# Altium project ESP_WROOM_02_Measurement_V1.PrjPCB
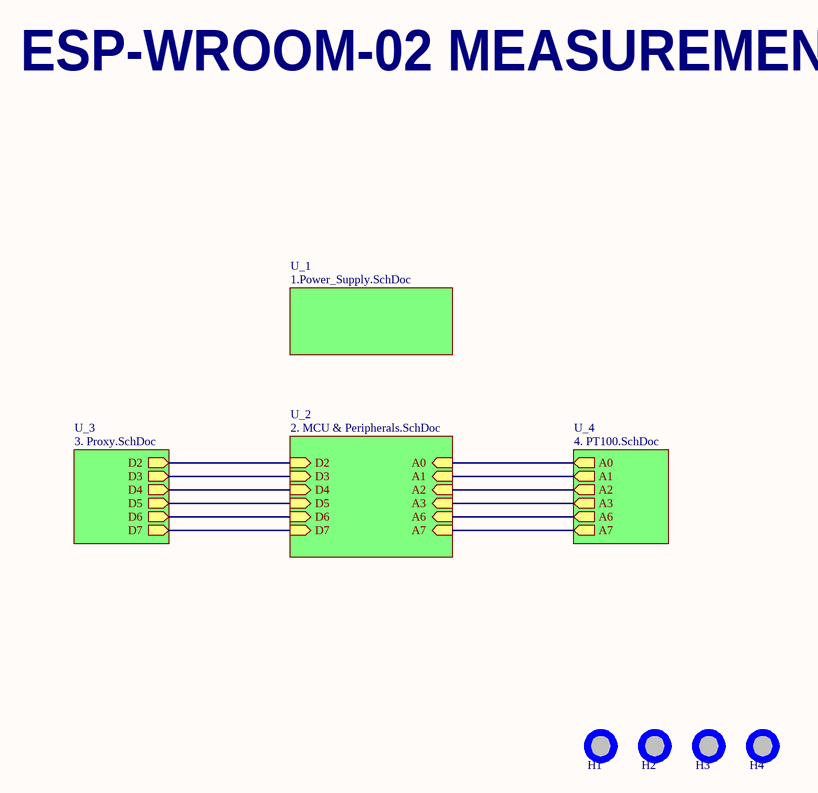
[diagram p0: Main_sch.SchDoc]
CompanyName: Keri Studio
5 sheets, 101 parts. Net scope: hierarchical (ports join the sheet entries above them; power ports are global).
Board file: Layout.PcbDoc
Sheets:
  Main_sch.SchDoc
    U_1 = 1.Power_Supply.SchDoc
    U_2 = 2. MCU & Peripherals.SchDoc
    U_3 = 3. Proxy.SchDoc
    U_4 = 4. PT100.SchDoc

## Sheet Main_sch.SchDoc: Main Schematic
size A4; CompanyName: Keri Studio; DrawnBy: Ashisg Talaviya; Organization: KERI STUDIO; Address1: ICG COMPOUND; Address2: NR. BHAVANI CIRCLE; Address3: A.K. ROAD; Address4: SURAT-395008; DocumentNumber: 0; Revision: 1.0; SheetNumber: 0; SheetTotal: 4

### Parts
H1  Hole  [Hole_4mm]  (value not drawn)  (no BOM)
H2  Hole  [Hole_4mm]  (value not drawn)  (no BOM)
H3  Hole  [Hole_4mm]  (value not drawn)  (no BOM)
H4  Hole  [Hole_4mm]  (value not drawn)  (no BOM)

### Sub-sheets
U_1 = 1.Power_Supply.SchDoc: no entries
U_2 = 2. MCU & Peripherals.SchDoc: A0 (in), A1 (in), A2 (in), A3 (in), A6 (in), A7 (in), D2 (in), D3 (in), D4 (in), D5 (in), D6 (in), D7 (in)
U_3 = 3. Proxy.SchDoc: D2 (out), D3 (out), D4 (out), D5 (out), D6 (out), D7 (out)
U_4 = 4. PT100.SchDoc: A0 (out), A1 (out), A2 (out), A3 (out), A6 (out), A7 (out)

### Nets
A0: sheet U_2/A0, sheet U_4/A0
A1: sheet U_2/A1, sheet U_4/A1
A2: sheet U_2/A2, sheet U_4/A2
A3: sheet U_2/A3, sheet U_4/A3
A6: sheet U_2/A6, sheet U_4/A6
A7: sheet U_2/A7, sheet U_4/A7
D2: sheet U_2/D2, sheet U_3/D2
D3: sheet U_2/D3, sheet U_3/D3
D4: sheet U_2/D4, sheet U_3/D4
D5: sheet U_2/D5, sheet U_3/D5
D6: sheet U_2/D6, sheet U_3/D6
D7: sheet U_2/D7, sheet U_3/D7

### Notes on the sheet
- ESP-WROOM-02 MEASUREMENT
- Title
- Size:
- A4
- Number:
- Revision:
- Date:
- Time:
- Sheet
- of

### Library data of the parts
H1-H4 = Hole: Corner Hole with 4mm Drill

## Sheet 1.Power_Supply.SchDoc: 1. Power Supply
size A4; CompanyName: Keri Studio; DrawnBy: Ashis Talaviya; Organization: KERI STUDIO; Address1: ICG COMPOUND; Address2: NR. BHAVANI CIRCLE; Address3: A.K. ROAD; Address4: SURAT-395008; DocumentNumber: 1; Revision: 1.0; SheetNumber: 1; SheetTotal: 4
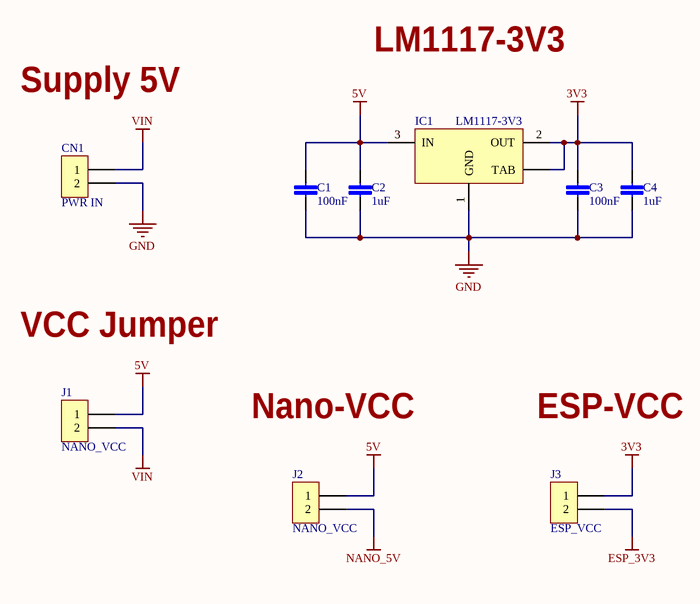
[diagram p1: 1.Power_Supply.SchDoc]

### Parts
C1  100nF  [C0805]
C2  1uF  [C0805]
C3  100nF  [C0805]
C4  1uF  [C0805]
CN1  PWR IN  [Terminal_5.08mm_1X02]
IC1  LM1117-3V3  [SOT223]
J1  NANO_VCC  [Header_2.54mm_1X02]
J2  NANO_VCC  [Header_2.54mm_1X02]
J3  ESP_VCC  [Header_2.54mm_1X02]

### Nets
3V3: C3.1 C4.1 IC1.2(OUT) IC1.4(TAB) J3.1
5V: C1.1 C2.1 IC1.3(IN) J1.1 J2.1
ESP_3V3: J3.2
GND: C1.2 C2.2 C3.2 C4.2 CN1.2 IC1.1(GND)
NANO_5V: J2.2
VIN: CN1.1 J1.2

### Notes on the sheet
- LM1117-3V3
- Supply 5V
- VCC Jumper
- Nano-VCC
- ESP-VCC
- Title
- Size:
- A4
- Number:
- Revision:
- Date:
- Time:
- Sheet
- of

### Library data of the parts
C1 C3 = C_0805_0.1uF: Multilayer Ceramic Capacitors MLCC - SMD/SMT 0805 0.1uF 50volts X7R 20%; Manufacturer: Murata; Manufacturer Part Number: GCJ21BR71H104MA01L; Supplier 1: Mouser; Supplier Part Number 1: 81-GCJ21BR71H104MA1L; Stock 1: 0
C2 C4 = C_0805_1uF: Multilayer Ceramic Capacitors MLCC - SMD/SMT 0805 1uF 50volts X7R 20%; Manufacturer: Murata; Manufacturer Part Number: GCJ21BR71H105MA01L; Supplier 1: Mouser; Supplier Part Number 1: 81-GCJ21BR71H105MA1L; Stock 1: 0; Pricing 1: 1=0.33, 10=0.231, 50=0.231, 100=0.139, 1000=0.088, 10000=0.074 (USD)
CN1 = Terminal_5.08mm_1X02: Fixed Terminal Blocks TERMI-BLOK PCB; Manufacturer: TE Connectivity; Manufacturer Part Number: 796682-2; Plating: Brass,Nickel; Number of Positions: 2; Number of Levels: 1; Current: 17.5A; Voltage: 300V; Connector Type: Receptacle; Closed End: No (Without); Interlock: Yes (With); Wire Gauge (Max): 30AWG; Pitch: 5mm; Thread Size: M3; Tail Length: 3.5mm; Supplier 1: Mouser; Stock 1: 1299; Pricing 1: 1=1.06, 10=0.737, 50=0.623, 100=0.62, 1000=0.441, 10000=0.367 (USD); Mount: Through Hole; Contact Plating: Tin; Contact Material: Brass; Colour: Black; Housing Material: Polyamide; Housing Colour: Black; Min Operating Temperature: -40°C; Max Operating Temperature: 105°C; Number of Rows: 1; Packaging: Bulk; Package Quantity: 300; Termination: Solder; Number of Positions Per Level: 2; Orientation: Straight; Max Current Rating: 17.5A; Current Rating: 17.5A; Voltage Rating: 300V; Number of Contacts: 2; Max Voltage Rating (AC): 300V; Number of Circuits: 2; Max Supply Voltage (AC): 300V; Screw Flange: No (Without); Screwless Terminal Block: No (Without); Side Stackable: No (Without); Length: 10.5mm; Height: 15.5mm; Wire Gauge (Min): 30AWG; Depth: 9mm; Width: 9mm; Radiation Hardening: No; Flammability Rating: UL94 V-0; Lead Free: Lead Free; ELV: Compliant; ComponentLink1URL: http://components.arrow.com/part/dataview/0323_03914338; ComponentLink1Description: http://components.arrow.com/part/dataview/0323_03914338; ComponentLink2URL: http://www.onlinecomponents.com/productFiles/mf-AMP/eng_cs_1308389_eurostyle_terminal_blocks_0607.pdf; ComponentLink2Description: http://www.onlinecomponents.com/productFiles/mf-AMP/eng_cs_1308389_eurostyle_terminal_blocks_0607.pdf; ComponentLink3URL: http://www.jameco.com/Jameco/Products/ProdDS/759341.pdf; ComponentLink3Description: http://www.jameco.com/Jameco/Products/ProdDS/759341.pdf; ComponentLink4URL: http://www.te.com/commerce/DocumentDelivery/DDEController?Action=showdoc&DocId=Catalog+Section%7F1308389_EUROSTYLE_TERMINAL_BLOCKS%7F0607%7Fpdf%7FEnglish%7FENG_CS_1308389_EUROSTYLE_TERMINAL_BLOCKS_0607.pdf; ComponentLink4Description: http://www.te.com/commerce/DocumentDelivery/DDEController?Action=showdoc&DocId=Catalog+Section%7F1308389_EUROSTYLE_TERMINAL_BLOCKS%7F0607%7Fpdf%7FEnglish%7FENG_CS_1308389_EUROSTYLE_TERMINAL_BLOCKS_0607.pdf; ComponentLink5URL: http://components.arrow.com/part/dataview/3050970S8348740N5665; ComponentLink5Description: http://components.arrow.com/part/dataview/3050970S8348740N5665; ComponentLink6URL: http://www.te.com/catalog/pn/en/796682-2?RQPN=796682-2; ComponentLink6Description: http://www.te.com/catalog/pn/en/796682-2?RQPN=796682-2; ComponentLink7URL: http://www.te.com/commerce/DocumentDelivery/DDEController?Action=srchrtrv&DocNm=796682&DocType=Customer+Drawing&DocLang=English; ComponentLink7Description: http://www.te.com/commerce/DocumentDelivery/DDEController?Action=srchrtrv&DocNm=796682&DocType=Customer+Drawing&DocLang=English; Supplier Part Number 1: 571-796682-2
IC1 = VREG_LM1117_3V3: IC, LINEAR VOLTAGE REGULATOR; Manufacturer: TI National Semiconductor; Manufacturer Part Number: LM1117MPX-3.3; Number of Outputs: 1; Output Voltage: 3.3V; Quiescent Current: 10mA; Output Current: 800mA; Dropout Voltage: 1.2V; Max Input Voltage: 15V; Polarity: Positive; Accuracy: 1%; Min Supply Voltage: 4.75V; Supplier 1: Mouser; Supplier Part Number 1: 926-LM1117MPX-33; Stock 1: 1423; Pricing 1: 1=1.54, 10=1.32, 50=1.32, 100=1.01, 1000=0.702, 10000=0.6 (USD); Mount: Surface Mount; Case/Package: SOT-223; Number of Pins: 4; Min Operating Temperature: -40°C; Max Operating Temperature: 125°C; Packaging: Tape and Reel; Current Rating: 800mA; Max Output Current: 800mA; Output Voltage Accuracy: 1%; Number of Regulators: 1; Min Current Limit: 800mA; Max Output Voltage: 3.3V; Max Supply Voltage: 15V; Termination: SMD/SMT; REACH SVHC: No SVHC; Lead Free: Contains Lead; ComponentLink1URL: https://datasheet.ciiva.com/8042/1882372-8042277.pdf; ComponentLink1Description: https://datasheet.ciiva.com/8042/1882372-8042277.pdf; ComponentLink2URL: https://datasheet.ciiva.com/1570/1831038-1570214.pdf; ComponentLink2Description: https://datasheet.ciiva.com/1570/1831038-1570214.pdf; ComponentLink3URL: https://datasheet.ciiva.com/1570/1772317-1570215.pdf; ComponentLink3Description: https://datasheet.ciiva.com/1570/1772317-1570215.pdf
J1-J3 = Header_2.54mm_1X02: TE Connectivity AMPMODU Mod II Series, 2.54mm Pitch 2 Way 1 Row Straight Breakaway Header, Solder Termination, 3A; Manufacturer Part Number: 826646-2; Number of Contacts: 2; Connector Type: Plug,Pin,Header; Board Standoff: No (Without); Plating Thickness: 0.8um; High Speed Serial Data Connector: No; PCB Mount Retention: Without; Mating Post Length: 5.8mm; Supplier 1: Mouser; Manufacturer: TE Connectivity; Stock 1: 37059; Pricing 1: 1=0.37, 10=0.343, 50=0.343, 100=0.263, 1000=0.189, 10000=0.157 (USD); Mount: Straddle Mount; Contact Plating: Tin,Gold; Colour: Green; Contact Material: Bronze; Housing Material: PBT; Housing Colour: Green; Contact Shape: Square; Min Operating Temperature: -65°C; Max Operating Temperature: 105°C; Number of Rows: 1; Termination: Through Hole; Packaging: Carton; Current Rating: 3A; Package Quantity: 3000; Contact Gender: Male; Number of Positions: 2; Orientation: Straight; Contact Protection: No (Without); Gasket: No (Without); High Temperature Housing: No; Keyed: No; Mating Alignment: No (Without); Mating Connector Lock: No (Without); Selectively Loaded: No (Without); Stabilizers: No (Without); Strain Relief: No (Without); Length: 5.08mm; Pitch: 2.54mm; Contact Mating Length: 0.228inch; Row Spacing: 2.54mm; Termination Post Length: 0.1259inch; Depth: 2.5mm; Radiation Hardening: No; Flammability Rating: UL94 V-0; ELV: Compliant; Lead Free: Lead Free; ComponentLink1URL: https://datasheet.ciiva.com/11746/0900766b80d7c469-11746485.pdf; ComponentLink1Description: https://datasheet.ciiva.com/11746/0900766b80d7c469-11746485.pdf; ComponentLink2URL: https://datasheet.ciiva.com/31842/8266462-31842526.pdf; ComponentLink2Description: https://datasheet.ciiva.com/31842/8266462-31842526.pdf; ComponentLink3URL: https://datasheet.ciiva.com/29369/001094740-da-01-en-stiftleiste-1-reihig-0-0826646-2-29369543.pdf; ComponentLink3Description: https://datasheet.ciiva.com/29369/001094740-da-01-en-stiftleiste-1-reihig-0-0826646-2-29369543.pdf; ComponentLink4URL: https://datasheet.ciiva.com/735/eng-cd-826629-aa-basefilename-735038.pdf; ComponentLink4Description: https://datasheet.ciiva.com/735/eng-cd-826629-aa-basefilename-735038.pdf; Supplier Part Number 1: 571-826646-2

## Sheet 2. MCU & Peripherals.SchDoc: 2. Arduino Nano & ESP-WROOM-32
size A4; CompanyName: Keri Studio; DrawnBy: Ashis Talaviya; Organization: KERI STUDIO; Address1: ICG COMPOUND; Address2: NR. BHAVANI CIRCLE; Address3: A.K. ROAD; Address4: SURAT-395008; DocumentNumber: 2; Revision: 1.0; SheetNumber: 2; SheetTotal: 4
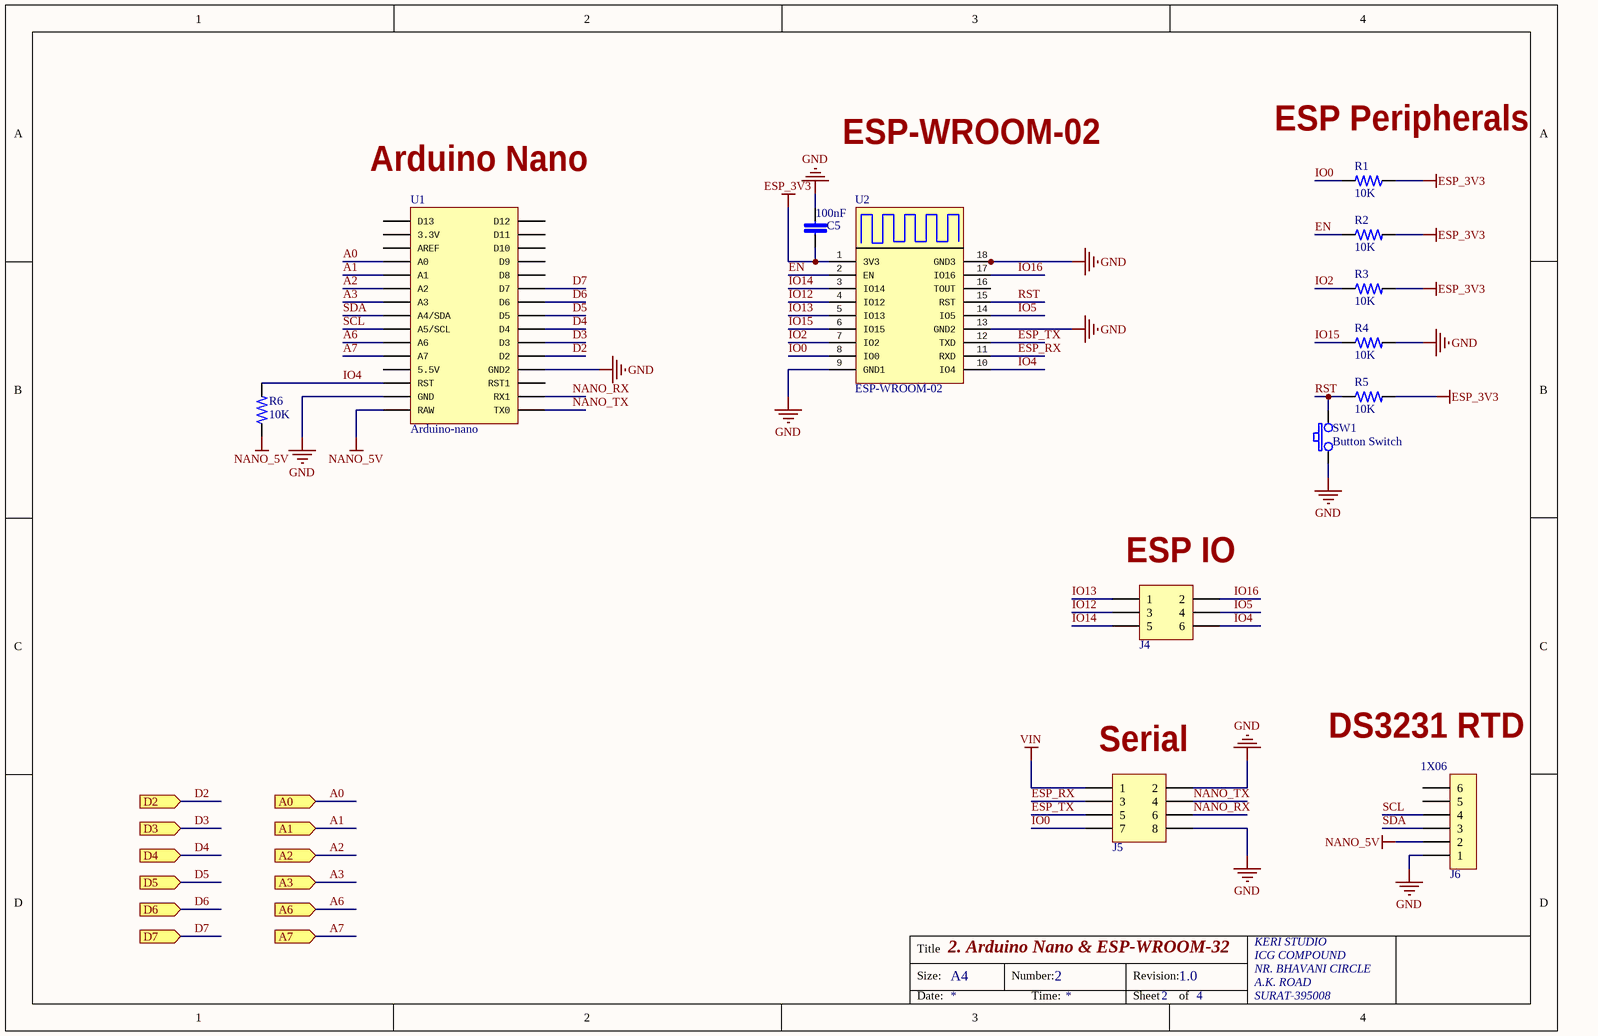
[diagram p2: 2. MCU & Peripherals.SchDoc]

### Parts
C5  100nF  [C0805]
J4  2X03  [Header_2.54mm_2X03]  (value not drawn)
J5  2X04  [Header_2.54mm_2X04]  (value not drawn)
J6  1X06  [Header_2.54mm_1X06]
R1  10K  [R0805]
R2  10K  [R0805]
R3  10K  [R0805]
R4  10K  [R0805]
R5  10K  [R0805]
R6  10K  [R0805]
SW1  Button Switch  [KSR231GLFS]
U1  Arduino-nano  [ARDUINO_NANO]
U2  ESP-WROOM-02  [ESP-WROOM-02]

### Ports
A0 (in), A1 (in), A2 (in), A3 (in), A6 (in), A7 (in), D2 (in), D3 (in), D4 (in), D5 (in), D6 (in), D7 (in)

### Nets
ESP_3V3: C5.2 R1.1 R2.2 R3.2 R5.2 U2.1(3V3)
GND: C5.1 J5.2 J5.8 J6.1 R4.2 SW1.1 U1.GND U1.GND1(GND2) U2.9(GND1) U2.13(GND2) U2.18(GND3) U2.19(GND0)
NANO_5V: J6.2 R6.1 U1.RAW
VIN: J5.1
A0: U1.A0 ; port A0
A1: U1.A1 ; port A1
A2: U1.A2 ; port A2
A3: U1.A3 ; port A3
A6: U1.A6 ; port A6
A7: U1.A7 ; port A7
D2: U1.D2 ; port D2
D3: U1.D3 ; port D3
D4: U1.D4 ; port D4
D5: U1.D5 ; port D5
D6: U1.D6 ; port D6
D7: U1.D7 ; port D7
EN: R2.1 U2.2(EN)
ESP_RX: J5.3 U2.11(RXD)
ESP_TX: J5.5 U2.12(TXD)
IO0: J5.7 R1.2 U2.8(IO0)
IO2: R3.1 U2.7(IO2)
IO4: J4.6 R6.2 U1.RST U2.10(IO4)
IO5: J4.4 U2.14(IO5)
IO12: J4.3 U2.4(IO12)
IO13: J4.1 U2.5(IO13)
IO14: J4.5 U2.3(IO14)
IO15: R4.1 U2.6(IO15)
IO16: J4.2 U2.17(IO16)
NANO_RX: J5.6 U1.RX1
NANO_TX: J5.4 U1.TX0
RST: R5.1 SW1.2 U2.15(RST)
SCL: J6.4 U1.A5(A5/SCL)
SDA: J6.3 U1.A4(A4/SDA)

Not connected (* = marked no-connect by the designer): J6 5 6; U1 3.3V 5V(5.5V) AREF D8 D9 D10 D11 D12 D13 RST1; U2 16(TOUT)

### Notes on the sheet
- (near U1) Arduino Nano
- ESP-WROOM-02
- (near R1) ESP Peripherals
- (near J4) ESP IO
- (near J5) Serial
- (near J6) DS3231 RTD
- Title
- Size:
- A4
- Number:
- Revision:
- Date:
- Time:
- Sheet
- of

### Library data of the parts
C5 = C_0805_0.1uF: as C1 on sheet 1.Power_Supply; Supplier 1: Mouser; Supplier Part Number 1: 81-GCJ21BR71H104MA1L; Stock 1: 0
J4 = Header_2.54mm_2X03: Headers & Wire Housings 03+03 DIL VERTICAL PIN HEADER TIN; Manufacturer: Harwin; Manufacturer Part Number: M20-9980346; Number of Contacts: 6; Contact Resistance: 25mR; Current Rating: 3A; Gender: Male; Insulation Resistance: 10GR; Connector Type: Male Pin; Pitch: 2.54mm; Row Spacing: 0.1inch; Supplier 1: Mouser; Stock 1: 8602; Pricing 1: 1=0.24, 10=0.229, 50=0.229, 100=0.159, 1000=0.11, 10000=0.089 (USD); Mount: Through Hole; Contact Plating: Nickel,Tin; Colour: Black; Contact Material: Bronze,Brass; Housing Colour: Black; Housing Material: Nylon; Min Operating Temperature: -40°C; Max Operating Temperature: 105°C; Number of Rows: 2; Termination: Solder; Package Quantity: 1000; Packaging: Bag; Max Current Rating: 3A; Number of Positions: 6; Orientation: Straight; Length: 7.62mm; Contact Mating Length: 0.24inch; Depth: 5.08mm; Radiation Hardening: No; REACH SVHC: No SVHC; ComponentLink1URL: https://datasheet.ciiva.com/11745/0900766b81034e61-11745752.pdf; ComponentLink1Description: https://datasheet.ciiva.com/11745/0900766b81034e61-11745752.pdf; ComponentLink2URL: https://datasheet.ciiva.com/26899/getdatasheetpartid-483857-26899433.pdf; ComponentLink2Description: https://datasheet.ciiva.com/26899/getdatasheetpartid-483857-26899433.pdf; ComponentLink3URL: https://datasheet.ciiva.com/8046/112195-8046906.pdf; ComponentLink3Description: https://datasheet.ciiva.com/8046/112195-8046906.pdf; Supplier Part Number 1: 855-M20-9980346
J5 = Header_2.54mm_2X04: Headers & Wire Housings 04+04 DIL VERTICAL PIN HEADER TIN; Manufacturer: Harwin; Manufacturer Part Number: M20-9980446; Number of Contacts: 8; Max Current Rating: 3A; Contact Resistance: 30mR; Gender: Male; Insulation Resistance: 10GR; Connector Type: Male Pin; Pitch: 2.54mm; Row Spacing: 0.1inch; Supplier 1: Mouser; Stock 1: 10983; Pricing 1: 1=0.3, 10=0.28, 50=0.28, 100=0.196, 1000=0.14, 10000=0.112 (USD); Mount: Through Hole; Contact Plating: Tin; Contact Material: Bronze,Brass; Colour: Black; Housing Colour: Black; Housing Material: Nylon; Min Operating Temperature: -40°C; Max Operating Temperature: 105°C; Number of Rows: 2; Termination: Solder; Current Rating: 3A; Package Quantity: 1000; Packaging: Bag; Number of Positions: 8; Orientation: Straight; Length: 10.16mm; Contact Mating Length: 0.24inch; Depth: 5.08mm; Radiation Hardening: No; REACH SVHC: No SVHC; ComponentLink1URL: https://datasheet.ciiva.com/11745/0900766b81034e61-11745748.pdf; ComponentLink1Description: https://datasheet.ciiva.com/11745/0900766b81034e61-11745748.pdf; ComponentLink2URL: https://datasheet.ciiva.com/6814/m20-998-6814757.pdf; ComponentLink2Description: https://datasheet.ciiva.com/6814/m20-998-6814757.pdf; ComponentLink3URL: https://datasheet.ciiva.com/9480/m20-998-9480200.pdf; ComponentLink3Description: https://datasheet.ciiva.com/9480/m20-998-9480200.pdf; ComponentLink4URL: https://datasheet.ciiva.com/26899/getdatasheetpartid-505183-26899434.pdf; ComponentLink4Description: https://datasheet.ciiva.com/26899/getdatasheetpartid-505183-26899434.pdf; ComponentLink5URL: https://datasheet.ciiva.com/8046/112195-8046909.pdf; ComponentLink5Description: https://datasheet.ciiva.com/8046/112195-8046909.pdf; Supplier Part Number 1: 855-M20-9980446
J6 = Header_2.54mm_1X06: CONNECTOR, 6WAY, VERTICAL, 2.54; Manufacturer: TE Connectivity; Manufacturer Part Number: 826646-6; Number of Contacts: 6; Connector Type: Plug,Pin,Header; PCB Mount Retention: Without; Board Standoff: No (Without); Keyed: No; Current Rating: 3A; Plating Thickness: 0.8um; Pitch: 2.54mm; Mating Post Length: 5.8mm; Supplier 1: Mouser; Stock 1: 1670; Pricing 1: 1=0.79, 10=0.693, 50=0.693, 100=0.598, 1000=0.435, 10000=0.354 (USD); Mount: Straddle Mount; Contact Plating: Tin,Gold; Contact Material: Bronze; Colour: Green; Housing Colour: Green; Housing Material: PBT; Contact Shape: Square; Min Operating Temperature: -65°C; Max Operating Temperature: 105°C; Number of Rows: 1; Termination: Through Hole; Packaging: Carton; Package Quantity: 1000; Number of Positions: 6; Orientation: Straight; PCB Mounting Orientation: Vertical; Contact Gender: Male; Contact Protection: No (Without); Gasket: No (Without); Mating Alignment: No (Without); Mating Connector Lock: No (Without); Selectively Loaded: No (Without); Stabilizers: No (Without); Strain Relief: No (Without); High Speed Serial Data Connector: No; High Temperature Housing: No; Length: 15.24mm; Termination Post Length: 0.1259inch; Contact Mating Length: 0.228inch; Row Spacing: 2.54mm; Depth: 2.5mm; Radiation Hardening: No; Flammability Rating: UL94 V-0; REACH SVHC: No SVHC; ComponentLink1URL: https://datasheet.ciiva.com/1448/47535-1448067.pdf; ComponentLink1Description: https://datasheet.ciiva.com/1448/47535-1448067.pdf; ComponentLink2URL: https://datasheet.ciiva.com/49517/abc918-49517591.pdf; ComponentLink2Description: https://datasheet.ciiva.com/49517/abc918-49517591.pdf; ComponentLink3URL: https://datasheet.ciiva.com/6816/eng-cd-826629-aa-basefilename-6816056.pdf; ComponentLink3Description: https://datasheet.ciiva.com/6816/eng-cd-826629-aa-basefilename-6816056.pdf; ComponentLink4URL: https://datasheet.ciiva.com/11754/0900766b80d7c469-11754285.pdf; ComponentLink4Description: https://datasheet.ciiva.com/11754/0900766b80d7c469-11754285.pdf; ComponentLink5URL: https://datasheet.ciiva.com/29369/001094744-da-01-en-stiftleiste-1-reihig-0-0826646-6-29369560.pdf; ComponentLink5Description: https://datasheet.ciiva.com/29369/001094744-da-01-en-stiftleiste-1-reihig-0-0826646-6-29369560.pdf; Supplier Part Number 1: 571-826646-6
R1-R6 = R_0805_10K: Thick Film Resistors - SMD 10K 0805 5%; Manufacturer: Bourns; Manufacturer Part Number: CR0805-JW-103ELF; Resistance: 10kR; Temperature Coefficient: 200ppm/°C; Power Rating: 125mW; Voltage Rating: 150V; Voltage Rating (DC): 100V; Supplier 1: Mouser; Supplier Part Number 1: 652-CR0805-JW-103ELF; Stock 1: 36802; Pricing 1: 1=0.1, 10=0.03, 50=0.03, 100=0.017, 1000=0.008, 10000=0.006 (USD); Mount: Surface Mount; Case/Package: 0805; Number of Pins: 2; Contact Plating: Tin; Case Code (Metric): 2012; Case Code (Imperial): 0805; Min Operating Temperature: -55°C; Max Operating Temperature: 155°C; Tolerance: 5%; Composition: Thick Film; Package Quantity: 1; Packaging: Tape and Reel; Number of Terminations: 2; Termination: SMD/SMT; Military Standard: Not; Max Power Dissipation: 125mW; Length: 2mm; Height: 0.5mm; Width: 1.25mm; Depth: 1.25mm; Thickness: 508um; Radiation Hardening: No; REACH SVHC: No SVHC; ComponentLink1URL: https://datasheet.ciiva.com/11821/0900766b80fcdb72-11821135.pdf; ComponentLink1Description: https://datasheet.ciiva.com/11821/0900766b80fcdb72-11821135.pdf; ComponentLink2URL: https://datasheet.ciiva.com/9122/chpreztr-9122374.pdf; ComponentLink2Description: https://datasheet.ciiva.com/9122/chpreztr-9122374.pdf; ComponentLink3URL: https://datasheet.ciiva.com/22693/1902866-22693254.pdf; ComponentLink3Description: https://datasheet.ciiva.com/22693/1902866-22693254.pdf; ComponentLink4URL: https://datasheet.ciiva.com/30065/159chpreztr-30065976.pdf; ComponentLink4Description: https://datasheet.ciiva.com/30065/159chpreztr-30065976.pdf; ComponentLink5URL: https://datasheet.ciiva.com/16783/70154685-16783482.pdf; ComponentLink5Description: https://datasheet.ciiva.com/16783/70154685-16783482.pdf; ComponentLink6URL: https://datasheet.ciiva.com/5548/chpreztr-5548491.pdf; ComponentLink6Description: https://datasheet.ciiva.com/5548/chpreztr-5548491.pdf; ComponentLink7URL: https://datasheet.ciiva.com/7986/691949-7986187.pdf; ComponentLink7Description: https://datasheet.ciiva.com/7986/691949-7986187.pdf; ComponentLink8URL: https://datasheet.ciiva.com/6559/chpreztr-6559900.pdf; ComponentLink8Description: https://datasheet.ciiva.com/6559/chpreztr-6559900.pdf; ComponentLink9URL: https://datasheet.ciiva.com/6559/chpreztr-6559901.pdf; ComponentLink9Description: https://datasheet.ciiva.com/6559/chpreztr-6559901.pdf; ComponentLink10URL: https://datasheet.ciiva.com/7985/1856384-7985869.pdf; ComponentLink10Description: https://datasheet.ciiva.com/7985/1856384-7985869.pdf; ComponentLink11URL: https://datasheet.ciiva.com/48692/001055517-da-01-en-smd-wid-cr0805-jw-103elf-10k-ohm-1-8w-48692118.pdf; ComponentLink11Description: https://datasheet.ciiva.com/48692/001055517-da-01-en-smd-wid-cr0805-jw-103elf-10k-ohm-1-8w-48692118.pdf
SW1 = Button_Switch: SWITCH TACTILE SPST-NO 0.05A 32V; Manufacturer: ITT C&K; Mechanical Life: 100000Cycles; Actuator Material: Rubber; Throw Configuration: SPST; Operating Force: 3N; Max Current Rating: 50mA; Contact Resistance: 100mR; Power Rating: 1W; Illumination Type: Non-Illuminated,Illuminated; Insulation Resistance: 1GR; Switch Travel: 0.35mm; Switch Function: Off-Mom; Actuator Length: 0.75mm; IP Rating: IP50; Supplier 1: Digi-Key; Supplier Part Number 1: 401-1706-6-ND; Stock 1: 11668; Pricing 1: 1=0.61, 10=0.585, 25=0.574, 50=0.5522, 100=0.4764, 250=0.43312, 500=0.41148, 1000=0.32485 (USD); Mount: Surface Mount; Contact Material: Silver; Contact Plating: Silver; Min Operating Temperature: -40°C; Max Operating Temperature: 85°C; Max Voltage Rating (DC): 32V; Termination: Gull Wing; Voltage Rating (DC): 32V; Packaging: Tape and Reel; Package Quantity: 1; Contact Current Rating: 50mA; Current Rating: 50mA; Orientation: Straight; Length: 7.3mm; Depth: 3.8mm; Width: 6mm; Radiation Hardening: No; REACH SVHC: No SVHC; Lead Free: Lead Free; ComponentLink1URL: https://datasheet.ciiva.com/7986/1728697-7986994.pdf; ComponentLink1Description: https://datasheet.ciiva.com/7986/1728697-7986994.pdf; ComponentLink2URL: https://datasheet.ciiva.com/30466/0900766b8129cd35-30466700.pdf; ComponentLink2Description: https://datasheet.ciiva.com/30466/0900766b8129cd35-30466700.pdf; ComponentLink3URL: https://datasheet.ciiva.com/2900/ksr-2900293.pdf; ComponentLink3Description: https://datasheet.ciiva.com/2900/ksr-2900293.pdf; ComponentLink4URL: https://datasheet.ciiva.com/2900/ksr-2900294.pdf; ComponentLink4Description: https://datasheet.ciiva.com/2900/ksr-2900294.pdf; ComponentLink5URL: https://datasheet.ciiva.com/2900/ksr-2900295.pdf; ComponentLink5Description: https://datasheet.ciiva.com/2900/ksr-2900295.pdf; ComponentLink6URL: https://datasheet.ciiva.com/46387/1780692-46387193.pdf; ComponentLink6Description: https://datasheet.ciiva.com/46387/1780692-46387193.pdf; ComponentLink7URL: https://datasheet.ciiva.com/5684/1728697-5684458.pdf; ComponentLink7Description: https://datasheet.ciiva.com/5684/1728697-5684458.pdf; ComponentLink8URL: https://datasheet.ciiva.com/16396/ksr231glfs-16396266.pdf; ComponentLink8Description: https://datasheet.ciiva.com/16396/ksr231glfs-16396266.pdf; ComponentLink9URL: https://datasheet.ciiva.com/22712/1728697-22712106.pdf; ComponentLink9Description: https://datasheet.ciiva.com/22712/1728697-22712106.pdf; ComponentLink10URL: https://datasheet.ciiva.com/8167/ksr-8167660.pdf; ComponentLink10Description: https://datasheet.ciiva.com/8167/ksr-8167660.pdf; ComponentLink11URL: https://datasheet.ciiva.com/5283/ksr-5283645.pdf; ComponentLink11Description: https://datasheet.ciiva.com/5283/ksr-5283645.pdf; Manufacturer Part Number: KSR231GLFS
U1 = Arduino-nano: ARDUINO   A000005   ATMEGA328, ARDUINO NANO, EVAL BOARD; Evaluation Kit: Yes; Interface: I2C,SPI,USB; Data Bus Width: 8b; Number of Bits: 8; Core Architecture: AVR; Operating Supply Voltage: 20V; Supplier 1: Mouser; Manufacturer: Arduino; Manufacturer Part Number: A000005; Stock 1: 0; Weight: 0.02lb; Package Quantity: 1; Packaging: Bulk; Length: 7inch; Height: 0.25inch; Width: 5inch; REACH SVHC: No SVHC; ComponentLink1URL: https://datasheet.ciiva.com/19455/2121148-19455443.pdf; ComponentLink1Description: https://datasheet.ciiva.com/19455/2121148-19455443.pdf; ComponentLink2URL: https://datasheet.ciiva.com/1336/1682238-1336473.pdf; ComponentLink2Description: https://datasheet.ciiva.com/1336/1682238-1336473.pdf; ComponentLink3URL: https://datasheet.ciiva.com/1414/810078-1414124.pdf; ComponentLink3Description: https://datasheet.ciiva.com/1414/810078-1414124.pdf; ComponentLink4URL: https://datasheet.ciiva.com/2398/arduinonanomanual23-2398236.pdf; ComponentLink4Description: https://datasheet.ciiva.com/2398/arduinonanomanual23-2398236.pdf; ComponentLink5URL: https://datasheet.ciiva.com/4926/arduino-arduinoboardnano-188748-4926316.pdf; ComponentLink5Description: https://datasheet.ciiva.com/4926/arduino-arduinoboardnano-188748-4926316.pdf; ComponentLink6URL: https://datasheet.ciiva.com/20168/73-4448-20168542.pdf; ComponentLink6Description: https://datasheet.ciiva.com/20168/73-4448-20168542.pdf; ComponentLink7URL: https://datasheet.ciiva.com/12069/arduino-arduinoboardnano-12069727.pdf; ComponentLink7Description: https://datasheet.ciiva.com/12069/arduino-arduinoboardnano-12069727.pdf; Supplier Part Number 1: 992-ARD-NANO30
U2 = ESP-WROOM-02: WiFi Modules (802.11) SMD Module, ESP8266EX, 16Mbits SPI flash, UART Mode; Manufacturer: Espressif Systems; Supplier 1: Mouser; Manufacturer Part Number: ESP-WROOM-02; Stock 1: 4063; Pricing 1: 1=2.7, 10=2.7, 50=2.7, 100=2.7, 1000=2.7, 10000=2.7 (USD); Supplier Part Number 1: 356-ESP-WROOM-02; ComponentLink1Description: Datasheet; ComponentLink1URL: https://espressif.com/sites/default/files/documentation/0c-esp-wroom-02_datasheet_en.pdf

## Sheet 3. Proxy.SchDoc: 3. Proxy
size A4; CompanyName: Keri Studio; DrawnBy: Ashish Talaviya; Organization: KERI STUDIO; Address1: ICG COMPOUND; Address2: NR. BHAVANI CIRCLE; Address3: A.K. ROAD; Address4: SURAT-395008; DocumentNumber: 3; Revision: 1.0; SheetNumber: 3; SheetTotal: 4
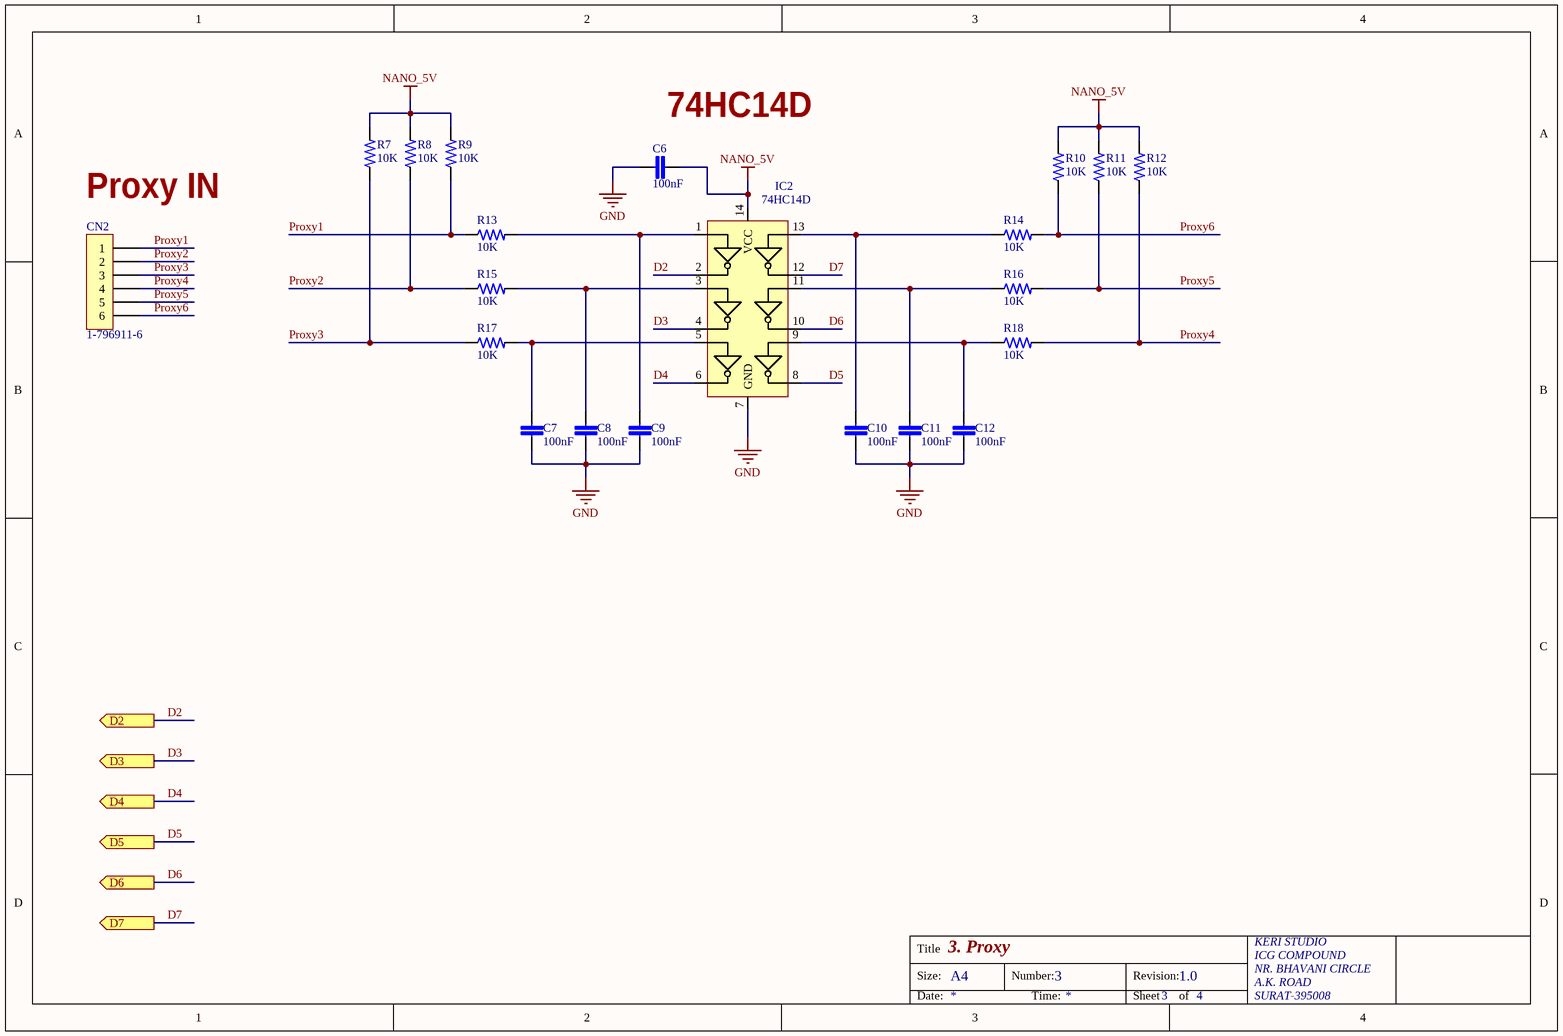
[diagram p3: 3. Proxy.SchDoc]

### Parts
C6  100nF  [C0805]
C7  100nF  [C0805]
C8  100nF  [C0805]
C9  100nF  [C0805]
C10  100nF  [C0805]
C11  100nF  [C0805]
C12  100nF  [C0805]
CN2  1-796911-6  [Terminal_5.08mm_1X06]
IC2  74HC14D  [SOIC-14]
R7  10K  [R0805]
R8  10K  [R0805]
R9  10K  [R0805]
R10  10K  [R0805]
R11  10K  [R0805]
R12  10K  [R0805]
R13  10K  [R0805]
R14  10K  [R0805]
R15  10K  [R0805]
R16  10K  [R0805]
R17  10K  [R0805]
R18  10K  [R0805]

### Ports
D2 (out), D3 (out), D4 (out), D5 (out), D6 (out), D7 (out)

### Nets
GND: C6.2 C7.2 C8.2 C9.2 C10.2 C11.2 C12.2 IC2.7(GND)
NANO_5V: C6.1 IC2.14(VCC) R7.2 R8.2 R9.2 R10.2 R11.2 R12.2
D2: IC2.2(1Y) ; port D2
D3: IC2.4(2Y) ; port D3
D4: IC2.6(3Y) ; port D4
D5: IC2.8(4Y) ; port D5
D6: IC2.10(5Y) ; port D6
D7: IC2.12(6Y) ; port D7
Proxy1: CN2.1 R9.1 R13.1
Proxy2: CN2.2 R8.1 R15.1
Proxy3: CN2.3 R7.1 R17.1
Proxy4: CN2.4 R12.1 R18.2
Proxy5: CN2.5 R11.1 R16.2
Proxy6: CN2.6 R10.1 R14.2
NetC7_1: C7.1 IC2.5(3A) R17.2
NetC8_1: C8.1 IC2.3(2A) R15.2
NetC9_1: C9.1 IC2.1(1A) R13.2
NetC10_1: C10.1 IC2.13(6A) R14.1
NetC11_1: C11.1 IC2.11(5A) R16.1
NetC12_1: C12.1 IC2.9(4A) R18.1

### Notes on the sheet
- (near C6) 74HC14D
- (near CN2) Proxy IN
- Title
- Size:
- A4
- Number:
- Revision:
- Date:
- Time:
- Sheet
- of

### Library data of the parts
C6-C12 = C_0805_0.1uF: as C1 on sheet 1.Power_Supply; Supplier 1: Mouser; Supplier Part Number 1: 81-GCJ21BR71H104MA1L; Stock 1: 0
CN2 = Terminal_5.08mm_1X06: Conn Terminal Block 16 POS 5mm Solder ST Thru-Hole; Manufacturer: TE Connectivity; Plating: Brass; Number of Levels: 1; Number of Positions Per Level: 16; Current: 17.5A; Voltage: 300V; Connector Type: Receptacle; Closed End: Yes (With); Screw Flange: No (Without); Wire Gauge (Max): 30AWG; Wire Gauge (Min): 12AWG; Pitch: 5.08mm; Thread Size: M3; Tail Length: 3.5mm; Supplier 1: Mouser; Manufacturer Part Number: 1-796911-6; Stock 1: 0; Mount: Through Hole; Colour: Green; Contact Plating: Tin; Contact Material: Brass; Housing Material: Polyamide; Housing Colour: Green; Package Quantity: 75; Packaging: Bulk; Termination: Screw; Number of Rows: 1; Interlock: Yes (With); Number of Positions: 16; Screwless Terminal Block: No (Without); Side Stackable: Yes (With); Orientation: Straight; Depth: 9mm; ELV: Compliant; Flammability Rating: UL94 V-0; ComponentLink1URL: https://datasheet.ciiva.com/824/eng-cd-796911-b2-824816.pdf; ComponentLink1Description: https://datasheet.ciiva.com/824/eng-cd-796911-b2-824816.pdf; Supplier Part Number 1: 571-1-796911-6
IC2 = 74HC14D: IC, HEX INVERTER, SCHMITT TRIGGER SOIC14; Manufacturer: NXP Semiconductors; Manufacturer Part Number: 74HC14D,653; Output Current: 25mA; Logic Function: Schmitt Trigger,Buffer,Inverter; Operating Supply Voltage: 5V; High Level Output Current: -5.2mA; Low Level Output Current: 5.2mA; Number of Elements: 6; Number of Inputs: 1; Min Supply Voltage: 2V; Max Supply Voltage: 6V; Propagation Delay: 190ns; Quiescent Current: 2uA; Turn-On Delay Time: 21ns; Supplier 1: Mouser; Stock 1: 0; Mount: Surface Mount; Case/Package: SO; Number of Pins: 14; Weight: 0.009143oz; Contact Plating: Gold; Min Operating Temperature: -40°C; Max Operating Temperature: 125°C; Packaging: Tape and Reel; Package Quantity: 2500; Number of Circuits: 6; Max Supply Voltage (DC): 6V; Min Supply Voltage (DC): 2V; Max Voltage Rating (DC): 6V; Length: 1inch; Height: 0.25inch; Width: 0.5inch; Radiation Hardening: No; REACH SVHC: No SVHC; Lead Free: Lead Free; ComponentLink1URL: https://datasheet.ciiva.com/1163/74hc-hct14-1163056.pdf; ComponentLink1Description: https://datasheet.ciiva.com/1163/74hc-hct14-1163056.pdf; ComponentLink2URL: https://datasheet.ciiva.com/33721/1678760-33721745.pdf; ComponentLink2Description: https://datasheet.ciiva.com/33721/1678760-33721745.pdf; ComponentLink3URL: https://datasheet.ciiva.com/15089/getdatasheetpartid-131068-15089257.pdf; ComponentLink3Description: https://datasheet.ciiva.com/15089/getdatasheetpartid-131068-15089257.pdf; ComponentLink4URL: https://datasheet.ciiva.com/1507/1678760-1507872.pdf; ComponentLink4Description: https://datasheet.ciiva.com/1507/1678760-1507872.pdf; ComponentLink5URL: https://datasheet.ciiva.com/1862/74hc-hct14-1862913.pdf; ComponentLink5Description: https://datasheet.ciiva.com/1862/74hc-hct14-1862913.pdf; ComponentLink6URL: https://datasheet.ciiva.com/1862/74hc-hct14-1862914.pdf; ComponentLink6Description: https://datasheet.ciiva.com/1862/74hc-hct14-1862914.pdf; ComponentLink7URL: https://datasheet.ciiva.com/1862/74hc-hct14-1862915.pdf; ComponentLink7Description: https://datasheet.ciiva.com/1862/74hc-hct14-1862915.pdf; ComponentLink8URL: https://datasheet.ciiva.com/22666/1678760-22666374.pdf; ComponentLink8Description: https://datasheet.ciiva.com/22666/1678760-22666374.pdf; ComponentLink9URL: https://datasheet.ciiva.com/4827/74hc-hct14-4827705.pdf; ComponentLink9Description: https://datasheet.ciiva.com/4827/74hc-hct14-4827705.pdf; ComponentLink10URL: https://datasheet.ciiva.com/36858/1678760-36858062.pdf; ComponentLink10Description: https://datasheet.ciiva.com/36858/1678760-36858062.pdf; Supplier Part Number 1: 771-74HC14D-T
R7-R18 = R_0805_10K: as R1 on sheet 2. MCU & Peripherals; Supplier 1: Mouser; Supplier Part Number 1: 652-CR0805-JW-103ELF; Stock 1: 36802; Pricing 1: 1=0.1, 10=0.03, 50=0.03, 100=0.017, 1000=0.008, 10000=0.006 (USD); Mount: Surface Mount; Case/Package: 0805; Number of Pins: 2; Contact Plating: Tin; Case Code (Metric): 2012; Case Code (Imperial): 0805; Min Operating Temperature: -55°C; Max Operating Temperature: 155°C; Tolerance: 5%; Composition: Thick Film; Package Quantity: 1; Packaging: Tape and Reel; Number of Terminations: 2; Termination: SMD/SMT; Military Standard: Not; Max Power Dissipation: 125mW; Length: 2mm; Height: 0.5mm; Width: 1.25mm; Depth: 1.25mm; Thickness: 508um; Radiation Hardening: No; REACH SVHC: No SVHC; ComponentLink1URL: https://datasheet.ciiva.com/11821/0900766b80fcdb72-11821135.pdf; ComponentLink1Description: https://datasheet.ciiva.com/11821/0900766b80fcdb72-11821135.pdf; ComponentLink2URL: https://datasheet.ciiva.com/9122/chpreztr-9122374.pdf; ComponentLink2Description: https://datasheet.ciiva.com/9122/chpreztr-9122374.pdf; ComponentLink3URL: https://datasheet.ciiva.com/22693/1902866-22693254.pdf; ComponentLink3Description: https://datasheet.ciiva.com/22693/1902866-22693254.pdf; ComponentLink4URL: https://datasheet.ciiva.com/30065/159chpreztr-30065976.pdf; ComponentLink4Description: https://datasheet.ciiva.com/30065/159chpreztr-30065976.pdf; ComponentLink5URL: https://datasheet.ciiva.com/16783/70154685-16783482.pdf; ComponentLink5Description: https://datasheet.ciiva.com/16783/70154685-16783482.pdf; ComponentLink6URL: https://datasheet.ciiva.com/5548/chpreztr-5548491.pdf; ComponentLink6Description: https://datasheet.ciiva.com/5548/chpreztr-5548491.pdf; ComponentLink7URL: https://datasheet.ciiva.com/7986/691949-7986187.pdf; ComponentLink7Description: https://datasheet.ciiva.com/7986/691949-7986187.pdf; ComponentLink8URL: https://datasheet.ciiva.com/6559/chpreztr-6559900.pdf; ComponentLink8Description: https://datasheet.ciiva.com/6559/chpreztr-6559900.pdf; ComponentLink9URL: https://datasheet.ciiva.com/6559/chpreztr-6559901.pdf; ComponentLink9Description: https://datasheet.ciiva.com/6559/chpreztr-6559901.pdf; ComponentLink10URL: https://datasheet.ciiva.com/7985/1856384-7985869.pdf; ComponentLink10Description: https://datasheet.ciiva.com/7985/1856384-7985869.pdf; ComponentLink11URL: https://datasheet.ciiva.com/48692/001055517-da-01-en-smd-wid-cr0805-jw-103elf-10k-ohm-1-8w-48692118.pdf; ComponentLink11Description: https://datasheet.ciiva.com/48692/001055517-da-01-en-smd-wid-cr0805-jw-103elf-10k-ohm-1-8w-48692118.pdf

## Sheet 4. PT100.SchDoc: 4. PT100
size A4; CompanyName: Keri Studio; DrawnBy: Ashish Talaviya; Organization: KERI STUDIO; Address1: ICG COMPOUND; Address2: NR. BHAVANI CIRCLE; Address3: A.K. ROAD; Address4: SURAT-395008; DocumentNumber: 4; Revision: 1.0; SheetNumber: 4; SheetTotal: 4
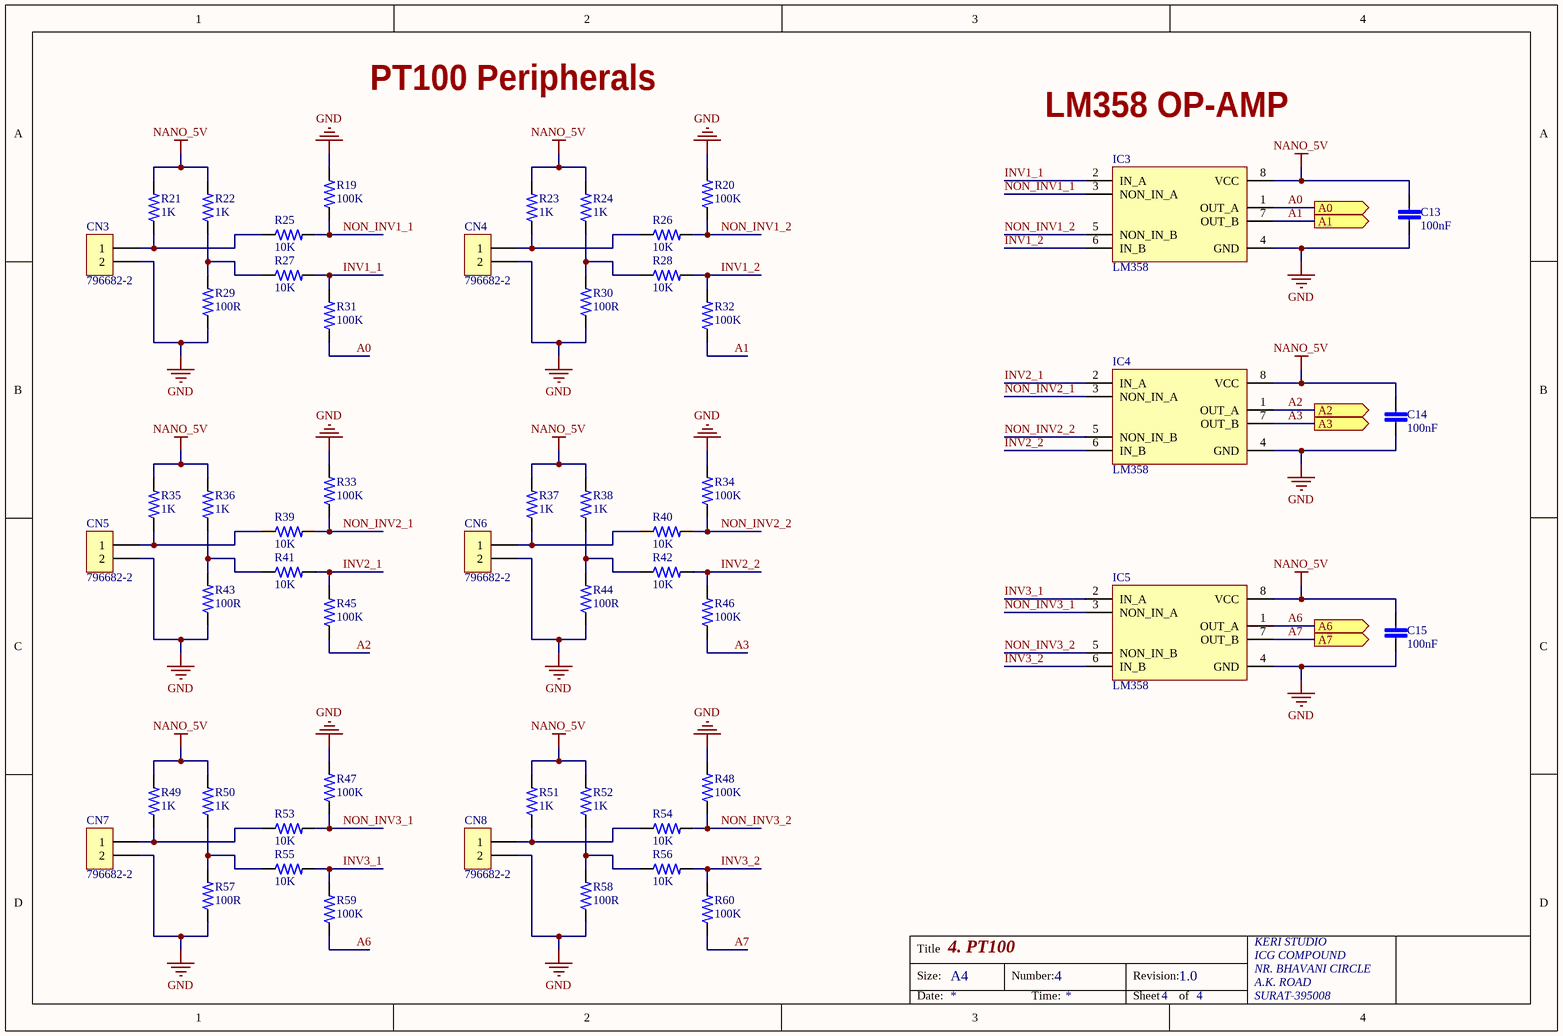
[diagram p4: 4. PT100.SchDoc]

### Parts
C13  100nF  [C0805]
C14  100nF  [C0805]
C15  100nF  [C0805]
CN3  796682-2  [Terminal_5.08mm_1X02]
CN4  796682-2  [Terminal_5.08mm_1X02]
CN5  796682-2  [Terminal_5.08mm_1X02]
CN6  796682-2  [Terminal_5.08mm_1X02]
CN7  796682-2  [Terminal_5.08mm_1X02]
CN8  796682-2  [Terminal_5.08mm_1X02]
IC3  LM358  [DIP-08]
IC4  LM358  [DIP-08]
IC5  LM358  [DIP-08]
R19  100K  [R0805]
R20  100K  [R0805]
R21  1K  [R0805]
R22  1K  [R0805]
R23  1K  [R0805]
R24  1K  [R0805]
R25  10K  [R0805]
R26  10K  [R0805]
R27  10K  [R0805]
R28  10K  [R0805]
R29  100R  [R0805]
R30  100R  [R0805]
R31  100K  [R0805]
R32  100K  [R0805]
R33  100K  [R0805]
R34  100K  [R0805]
R35  1K  [R0805]
R36  1K  [R0805]
R37  1K  [R0805]
R38  1K  [R0805]
R39  10K  [R0805]
R40  10K  [R0805]
R41  10K  [R0805]
R42  10K  [R0805]
R43  100R  [R0805]
R44  100R  [R0805]
R45  100K  [R0805]
R46  100K  [R0805]
R47  100K  [R0805]
R48  100K  [R0805]
R49  1K  [R0805]
R50  1K  [R0805]
R51  1K  [R0805]
R52  1K  [R0805]
R53  10K  [R0805]
R54  10K  [R0805]
R55  10K  [R0805]
R56  10K  [R0805]
R57  100R  [R0805]
R58  100R  [R0805]
R59  100K  [R0805]
R60  100K  [R0805]

### Ports
A0 (out), A1 (out), A2 (out), A3 (out), A6 (out), A7 (out)

### Nets
GND: C13.2 C14.2 C15.2 CN3.2 CN4.2 CN5.2 CN6.2 CN7.2 CN8.2 IC3.4(GND) IC4.4(GND) IC5.4(GND) R19.2 R20.2 R29.1 R30.1 R33.2 R34.2 R43.1 R44.1 R47.2 R48.2 R57.1 R58.1
NANO_5V: C13.1 C14.1 C15.1 IC3.8(VCC) IC4.8(VCC) IC5.8(VCC) R21.2 R22.2 R23.2 R24.2 R35.2 R36.2 R37.2 R38.2 R49.2 R50.2 R51.2 R52.2
A0: IC3.1(OUT_A) R31.1 ; port A0
A1: IC3.7(OUT_B) R32.1 ; port A1
A2: IC4.1(OUT_A) R45.1 ; port A2
A3: IC4.7(OUT_B) R46.1 ; port A3
A6: IC5.1(OUT_A) R59.1 ; port A6
A7: IC5.7(OUT_B) R60.1 ; port A7
INV1_1: IC3.2(IN_A) R27.2 R31.2
INV1_2: IC3.6(IN_B) R28.2 R32.2
INV2_1: IC4.2(IN_A) R41.2 R45.2
INV2_2: IC4.6(IN_B) R42.2 R46.2
INV3_1: IC5.2(IN_A) R55.2 R59.2
INV3_2: IC5.6(IN_B) R56.2 R60.2
NON_INV1_1: IC3.3(NON_IN_A) R19.1 R25.2
NON_INV1_2: IC3.5(NON_IN_B) R20.1 R26.2
NON_INV2_1: IC4.3(NON_IN_A) R33.1 R39.2
NON_INV2_2: IC4.5(NON_IN_B) R34.1 R40.2
NON_INV3_1: IC5.3(NON_IN_A) R47.1 R53.2
NON_INV3_2: IC5.5(NON_IN_B) R48.1 R54.2
NetCN3_1: CN3.1 R21.1 R25.1
NetCN4_1: CN4.1 R23.1 R26.1
NetCN5_1: CN5.1 R35.1 R39.1
NetCN6_1: CN6.1 R37.1 R40.1
NetCN7_1: CN7.1 R49.1 R53.1
NetCN8_1: CN8.1 R51.1 R54.1
NetR22_1: R22.1 R27.1 R29.2
NetR24_1: R24.1 R28.1 R30.2
NetR36_1: R36.1 R41.1 R43.2
NetR38_1: R38.1 R42.1 R44.2
NetR50_1: R50.1 R55.1 R57.2
NetR52_1: R52.1 R56.1 R58.2

### Notes on the sheet
- PT100 Peripherals
- LM358 OP-AMP
- Title
- Size:
- A4
- Number:
- Revision:
- Date:
- Time:
- Sheet
- of

### Library data of the parts
C13-C15 = C_0805_0.1uF: as C1 on sheet 1.Power_Supply; Supplier 1: Mouser; Supplier Part Number 1: 81-GCJ21BR71H104MA1L; Stock 1: 0
CN3-CN8 = Terminal_5.08mm_1X02: Fixed Terminal Blocks TERMI-BLOK PCB; Manufacturer: TE Connectivity; Plating: Brass,Nickel; Number of Positions: 2; Number of Levels: 1; Current: 17.5A; Voltage: 300V; Connector Type: Receptacle; Closed End: No (Without); Interlock: Yes (With); Wire Gauge (Max): 30AWG; Pitch: 5mm; Thread Size: M3; Tail Length: 3.5mm; Supplier 1: Mouser; Manufacturer Part Number: 796682-2; Stock 1: 1299; Pricing 1: 1=1.06, 10=0.737, 50=0.623, 100=0.62, 1000=0.441, 10000=0.367 (USD); Mount: Through Hole; Contact Plating: Tin; Contact Material: Brass; Colour: Black; Housing Material: Polyamide; Housing Colour: Black; Min Operating Temperature: -40°C; Max Operating Temperature: 105°C; Number of Rows: 1; Packaging: Bulk; Package Quantity: 300; Termination: Solder; Number of Positions Per Level: 2; Orientation: Straight; Max Current Rating: 17.5A; Current Rating: 17.5A; Voltage Rating: 300V; Number of Contacts: 2; Max Voltage Rating (AC): 300V; Number of Circuits: 2; Max Supply Voltage (AC): 300V; Screw Flange: No (Without); Screwless Terminal Block: No (Without); Side Stackable: No (Without); Length: 10.5mm; Height: 15.5mm; Wire Gauge (Min): 30AWG; Depth: 9mm; Width: 9mm; Radiation Hardening: No; Flammability Rating: UL94 V-0; Lead Free: Lead Free; ELV: Compliant; ComponentLink1URL: http://components.arrow.com/part/dataview/0323_03914338; ComponentLink1Description: http://components.arrow.com/part/dataview/0323_03914338; ComponentLink2URL: http://www.onlinecomponents.com/productFiles/mf-AMP/eng_cs_1308389_eurostyle_terminal_blocks_0607.pdf; ComponentLink2Description: http://www.onlinecomponents.com/productFiles/mf-AMP/eng_cs_1308389_eurostyle_terminal_blocks_0607.pdf; ComponentLink3URL: http://www.jameco.com/Jameco/Products/ProdDS/759341.pdf; ComponentLink3Description: http://www.jameco.com/Jameco/Products/ProdDS/759341.pdf; ComponentLink4URL: http://www.te.com/commerce/DocumentDelivery/DDEController?Action=showdoc&DocId=Catalog+Section%7F1308389_EUROSTYLE_TERMINAL_BLOCKS%7F0607%7Fpdf%7FEnglish%7FENG_CS_1308389_EUROSTYLE_TERMINAL_BLOCKS_0607.pdf; ComponentLink4Description: http://www.te.com/commerce/DocumentDelivery/DDEController?Action=showdoc&DocId=Catalog+Section%7F1308389_EUROSTYLE_TERMINAL_BLOCKS%7F0607%7Fpdf%7FEnglish%7FENG_CS_1308389_EUROSTYLE_TERMINAL_BLOCKS_0607.pdf; ComponentLink5URL: http://components.arrow.com/part/dataview/3050970S8348740N5665; ComponentLink5Description: http://components.arrow.com/part/dataview/3050970S8348740N5665; ComponentLink6URL: http://www.te.com/catalog/pn/en/796682-2?RQPN=796682-2; ComponentLink6Description: http://www.te.com/catalog/pn/en/796682-2?RQPN=796682-2; ComponentLink7URL: http://www.te.com/commerce/DocumentDelivery/DDEController?Action=srchrtrv&DocNm=796682&DocType=Customer+Drawing&DocLang=English; ComponentLink7Description: http://www.te.com/commerce/DocumentDelivery/DDEController?Action=srchrtrv&DocNm=796682&DocType=Customer+Drawing&DocLang=English; Supplier Part Number 1: 571-796682-2
IC3-IC5 = LM358: IC OPAMP GP 700KHZ 8SOIC; Manufacturer: Texas Instruments; Manufacturer Part Number: LM358ADR; Min Supply Voltage: 3V; Max Supply Voltage: 32V; Min Dual Supply Voltage: 1.5V; Max Dual Supply Voltage: 16V; Voltage Gain: 100dB; Slew Rate: 0.3V/µs; Common Mode Rejection Ratio: 65dB; Number of Channels: 2; Output Current: 30mA; Nominal Supply Current: 1.2mA; Input Bias Current: 100nA; Input Offset Voltage (Vos): 3mV; Operating Supply Current: 1mA; Dual Supply Voltage: 9V; Supplier 1: Mouser; Stock 1: 276952; Pricing 1: 1=0.36, 10=0.271, 50=0.271, 100=0.147, 1000=0.11, 10000=0.089 (USD); Mount: Surface Mount; Case/Package: SOIC; Number of Pins: 8; Min Operating Temperature: 0°C; Max Operating Temperature: 70°C; Packaging: Tape and Reel; Package Quantity: 2500; Operating Supply Voltage: 16V; Number of Circuits: 2; Gain Bandwidth Product: 700kHz; Output Current per Channel: 30mA; Number of Elements: 2; Unity Gain Bandwidth Product: 700kHz; Bandwidth: 700kHz; Number of Amplifiers: 2; Length: 4.9mm; Height: 1.58mm; Width: 3.91mm; Radiation Hardening: No; Lead Free: Lead Free; REACH SVHC: No SVHC; ComponentLink1URL: https://datasheet.ciiva.com/1796/lm358-1796562.pdf; ComponentLink1Description: https://datasheet.ciiva.com/1796/lm358-1796562.pdf; ComponentLink2URL: https://datasheet.ciiva.com/1796/lm358-1796563.pdf; ComponentLink2Description: https://datasheet.ciiva.com/1796/lm358-1796563.pdf; ComponentLink3URL: https://datasheet.ciiva.com/1796/lm358-1796564.pdf; ComponentLink3Description: https://datasheet.ciiva.com/1796/lm358-1796564.pdf; ComponentLink4URL: https://datasheet.ciiva.com/2973/lm358a-2973371.pdf; ComponentLink4Description: https://datasheet.ciiva.com/2973/lm358a-2973371.pdf; Supplier Part Number 1: 595-LM358ADR
R19 R20 R31-R34 R45-R48 R59 R60 = R_0805_100K: Thick Film Resistors - SMD 100K 0805 5%; Manufacturer: Bourns; Manufacturer Part Number: CR0805-JW-104ELF; Resistance: 100kR; Temperature Coefficient: 200ppm/°C; Voltage Rating: 150V; Power Rating: 125mW; Supplier 1: Mouser; Supplier Part Number 1: 652-CR0805JW-104ELF; Stock 1: 38668; Pricing 1: 1=0.1, 10=0.068, 50=0.068, 100=0.028, 1000=0.011, 10000=0.006 (USD); Mount: Surface Mount; Case/Package: 0805; Contact Plating: Tin; Case Code (Imperial): 0805; Case Code (Metric): 2012; Min Operating Temperature: -55°C; Max Operating Temperature: 155°C; Tolerance: 5%; Composition: Thick Film; Package Quantity: 5000; Packaging: Tape and Reel; Termination: SMD/SMT; Military Standard: Not; Voltage Rating (DC): 150V; Length: 2mm; Height: 0.5mm; Width: 1.25mm; Depth: 1.25mm; Thickness: 508um; Radiation Hardening: No; REACH SVHC: No SVHC; ComponentLink1URL: https://datasheet.ciiva.com/11809/0900766b80fcdb72-11809030.pdf; ComponentLink1Description: https://datasheet.ciiva.com/11809/0900766b80fcdb72-11809030.pdf; ComponentLink2URL: https://datasheet.ciiva.com/9120/chpreztr-9120778.pdf; ComponentLink2Description: https://datasheet.ciiva.com/9120/chpreztr-9120778.pdf
R21-R24 R35-R38 R49-R52 = R_0805_1K: Thick Film Resistors - SMD 1K 5%; Manufacturer: Bourns; Manufacturer Part Number: CR0805-JW-102ELF; Resistance: 1kR; Temperature Coefficient: 200ppm/°C; Power Rating: 125mW; Voltage Rating: 150V; Supplier 1: Mouser; Stock 1: 29079; Pricing 1: 1=0.1, 10=0.03, 50=0.03, 100=0.017, 1000=0.008, 10000=0.006 (USD); Mount: Surface Mount; Case/Package: 0805; Number of Pins: 2; Contact Plating: Tin; Case Code (Metric): 2012; Case Code (Imperial): 0805; Min Operating Temperature: -55°C; Max Operating Temperature: 155°C; Tolerance: 5%; Composition: Thick Film; Package Quantity: 1; Packaging: Tape and Reel; Number of Terminations: 2; Termination: SMD/SMT; Military Standard: Not; Max Power Dissipation: 125mW; Voltage Rating (DC): 150V; Length: 2mm; Height: 0.5mm; Width: 1.25mm; Depth: 1.25mm; Thickness: 508um; Radiation Hardening: No; REACH SVHC: No SVHC; Lead Free: Lead Free; ComponentLink1URL: https://datasheet.ciiva.com/11821/0900766b80fcdb72-11821134.pdf; ComponentLink1Description: https://datasheet.ciiva.com/11821/0900766b80fcdb72-11821134.pdf; ComponentLink2URL: https://datasheet.ciiva.com/15225/getdatasheetpartid-78155-15225381.pdf; ComponentLink2Description: https://datasheet.ciiva.com/15225/getdatasheetpartid-78155-15225381.pdf; ComponentLink3URL: https://datasheet.ciiva.com/22693/1902866-22693253.pdf; ComponentLink3Description: https://datasheet.ciiva.com/22693/1902866-22693253.pdf; ComponentLink4URL: https://datasheet.ciiva.com/7986/1856384-7986184.pdf; ComponentLink4Description: https://datasheet.ciiva.com/7986/1856384-7986184.pdf; ComponentLink5URL: https://datasheet.ciiva.com/16934/chpreztr-16934442.pdf; ComponentLink5Description: https://datasheet.ciiva.com/16934/chpreztr-16934442.pdf; ComponentLink6URL: https://datasheet.ciiva.com/7985/1856384-7985867.pdf; ComponentLink6Description: https://datasheet.ciiva.com/7985/1856384-7985867.pdf; ComponentLink7URL: https://datasheet.ciiva.com/30242/159chpreztr-30242765.pdf; ComponentLink7Description: https://datasheet.ciiva.com/30242/159chpreztr-30242765.pdf; ComponentLink8URL: https://datasheet.ciiva.com/6547/chpreztr-6547359.pdf; ComponentLink8Description: https://datasheet.ciiva.com/6547/chpreztr-6547359.pdf; Supplier Part Number 1: 652-CR0805JW-102ELF
R25-R28 R39-R42 R53-R56 = R_0805_10K: as R1 on sheet 2. MCU & Peripherals; Supplier 1: Mouser; Supplier Part Number 1: 652-CR0805-JW-103ELF; Stock 1: 36802; Pricing 1: 1=0.1, 10=0.03, 50=0.03, 100=0.017, 1000=0.008, 10000=0.006 (USD); Mount: Surface Mount; Case/Package: 0805; Number of Pins: 2; Contact Plating: Tin; Case Code (Metric): 2012; Case Code (Imperial): 0805; Min Operating Temperature: -55°C; Max Operating Temperature: 155°C; Tolerance: 5%; Composition: Thick Film; Package Quantity: 1; Packaging: Tape and Reel; Number of Terminations: 2; Termination: SMD/SMT; Military Standard: Not; Max Power Dissipation: 125mW; Length: 2mm; Height: 0.5mm; Width: 1.25mm; Depth: 1.25mm; Thickness: 508um; Radiation Hardening: No; REACH SVHC: No SVHC; ComponentLink1URL: https://datasheet.ciiva.com/11821/0900766b80fcdb72-11821135.pdf; ComponentLink1Description: https://datasheet.ciiva.com/11821/0900766b80fcdb72-11821135.pdf; ComponentLink2URL: https://datasheet.ciiva.com/9122/chpreztr-9122374.pdf; ComponentLink2Description: https://datasheet.ciiva.com/9122/chpreztr-9122374.pdf; ComponentLink3URL: https://datasheet.ciiva.com/22693/1902866-22693254.pdf; ComponentLink3Description: https://datasheet.ciiva.com/22693/1902866-22693254.pdf; ComponentLink4URL: https://datasheet.ciiva.com/30065/159chpreztr-30065976.pdf; ComponentLink4Description: https://datasheet.ciiva.com/30065/159chpreztr-30065976.pdf; ComponentLink5URL: https://datasheet.ciiva.com/16783/70154685-16783482.pdf; ComponentLink5Description: https://datasheet.ciiva.com/16783/70154685-16783482.pdf; ComponentLink6URL: https://datasheet.ciiva.com/5548/chpreztr-5548491.pdf; ComponentLink6Description: https://datasheet.ciiva.com/5548/chpreztr-5548491.pdf; ComponentLink7URL: https://datasheet.ciiva.com/7986/691949-7986187.pdf; ComponentLink7Description: https://datasheet.ciiva.com/7986/691949-7986187.pdf; ComponentLink8URL: https://datasheet.ciiva.com/6559/chpreztr-6559900.pdf; ComponentLink8Description: https://datasheet.ciiva.com/6559/chpreztr-6559900.pdf; ComponentLink9URL: https://datasheet.ciiva.com/6559/chpreztr-6559901.pdf; ComponentLink9Description: https://datasheet.ciiva.com/6559/chpreztr-6559901.pdf; ComponentLink10URL: https://datasheet.ciiva.com/7985/1856384-7985869.pdf; ComponentLink10Description: https://datasheet.ciiva.com/7985/1856384-7985869.pdf; ComponentLink11URL: https://datasheet.ciiva.com/48692/001055517-da-01-en-smd-wid-cr0805-jw-103elf-10k-ohm-1-8w-48692118.pdf; ComponentLink11Description: https://datasheet.ciiva.com/48692/001055517-da-01-en-smd-wid-cr0805-jw-103elf-10k-ohm-1-8w-48692118.pdf
R29 R30 R43 R44 R57 R58 = R_0805_100R: Thick Film Resistors - SMD 10ohm 5%; Manufacturer: Bourns; Manufacturer Part Number: CR0805-JW-100ELF; Resistance: 10R; Temperature Coefficient: 200ppm/°C; Power Rating: 125mW; Voltage Rating: 150V; Supplier 1: Mouser; Stock 1: 30420; Pricing 1: 1=0.1, 10=0.068, 50=0.068, 100=0.028, 1000=0.011, 10000=0.006 (USD); Mount: Surface Mount; Case/Package: 0805; Contact Plating: Tin; Case Code (Imperial): 0805; Case Code (Metric): 2012; Min Operating Temperature: -55°C; Max Operating Temperature: 155°C; Tolerance: 5%; Composition: Thick Film; Packaging: Tape and Reel; Package Quantity: 5000; Termination: SMD/SMT; Number of Terminations: 2; Military Standard: Not; Max Power Dissipation: 125mW; Voltage Rating (DC): 150V; Length: 2mm; Height: 0.5mm; Width: 1.25mm; Depth: 1.25mm; Thickness: 508um; Radiation Hardening: No; REACH SVHC: No SVHC; ComponentLink1URL: https://datasheet.ciiva.com/11808/0900766b80fcdb72-11808714.pdf; ComponentLink1Description: https://datasheet.ciiva.com/11808/0900766b80fcdb72-11808714.pdf; ComponentLink2URL: https://datasheet.ciiva.com/16934/chpreztr-16934424.pdf; ComponentLink2Description: https://datasheet.ciiva.com/16934/chpreztr-16934424.pdf; Supplier Part Number 1: 652-CR0805JW-100ELF

## Nets that join several sheets
ESP_3V3: 1.Power_Supply (J3.2), 2. MCU & Peripherals (6 pins)
GND: 1.Power_Supply (6 pins), 2. MCU & Peripherals (12 pins), 3. Proxy (8 pins), 4. PT100 (24 pins)
NANO_5V: 1.Power_Supply (J2.2), 2. MCU & Peripherals (J6.2 R6.1 U1.RAW), 3. Proxy (8 pins), 4. PT100 (18 pins)
VIN: 1.Power_Supply (CN1.1 J1.2), 2. MCU & Peripherals (J5.1)
A0: 2. MCU & Peripherals (U1.A0), 4. PT100 (IC3.1 R31.1)
A1: 2. MCU & Peripherals (U1.A1), 4. PT100 (IC3.7 R32.1)
A2: 2. MCU & Peripherals (U1.A2), 4. PT100 (IC4.1 R45.1)
A3: 2. MCU & Peripherals (U1.A3), 4. PT100 (IC4.7 R46.1)
A6: 2. MCU & Peripherals (U1.A6), 4. PT100 (IC5.1 R59.1)
A7: 2. MCU & Peripherals (U1.A7), 4. PT100 (IC5.7 R60.1)
D2: 2. MCU & Peripherals (U1.D2), 3. Proxy (IC2.2)
D3: 2. MCU & Peripherals (U1.D3), 3. Proxy (IC2.4)
D4: 2. MCU & Peripherals (U1.D4), 3. Proxy (IC2.6)
D5: 2. MCU & Peripherals (U1.D5), 3. Proxy (IC2.8)
D6: 2. MCU & Peripherals (U1.D6), 3. Proxy (IC2.10)
D7: 2. MCU & Peripherals (U1.D7), 3. Proxy (IC2.12)